# EAGLE design futurew (EAGLE 9.5.2)
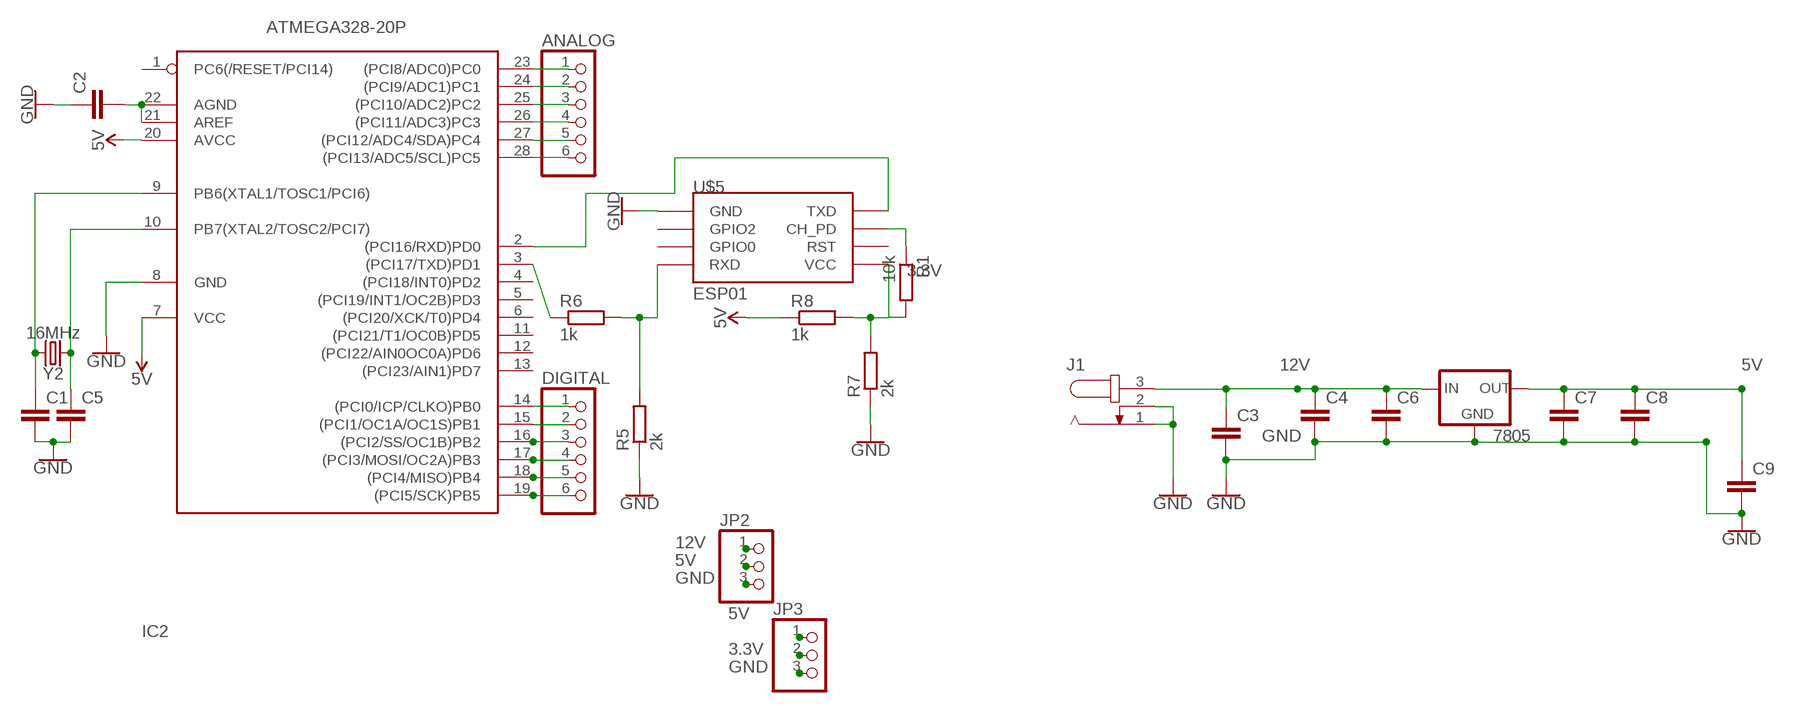
[diagram p0: schematic, sheet 1]

## Parts
7805  78XXL  [78XXL]
ANALOG  PINHD-1X6  [1X06]
C1  C2,5-3  [C2.5-3]
C2  C2,5-3  [C2.5-3]
C3  C2,5-3  [C2.5-3]
C4  C2,5-3  [C2.5-3]
C5  C2,5-3  [C2.5-3]
C6  C2,5-3  [C2.5-3]
C7  C2,5-3  [C2.5-3]
C8  C2,5-3  [C2.5-3]
C9  C2,5-3  [C2.5-3]
DIGITAL  PINHD-1X6  [1X06]
IC2  ATMEGA328-20P  [DIL28-3]
J1  JACK-PLUG1  [SPC4078]
JP2  PINHD-1X3  [1X03]
JP3  PINHD-1X3  [1X03]
R1  10k  R-EU_0204/5  [0204/5]
R5  2k  R-EU_0204/5  [0204/5]
R6  1k  R-EU_0204/5  [0204/5]
R7  2k  R-EU_0204/5  [0204/5]
R8  1k  R-EU_0204/5  [0204/5]
U$5  ESP01  [ESP01]
Y2  16MHz  CRYSTAL-16MHZPTH-HC49US  [HC49US]

## Nets
3.3V: JP3.2 R7.2 R8.2 U$5.VCC
5V: 7805.OUT C7.1 C8.1 C9.1 IC2.7(VCC) IC2.20(AVCC) JP2.2 JP3.1 R8.1
12V: 7805.IN C3.1 C4.1 C6.1 J1.3 JP2.1
GND: 7805.GND C1.2 C2.1 C3.2 C4.2 C5.2 C6.2 C7.2 C8.2 C9.2 IC2.8(GND) J1.1 J1.2 JP2.3 JP3.3 R5.1 R7.1 U$5.GND
N$1: R5.2 R6.2 U$5.RX(RXD)
N$2: IC2.3((PCI17/TXD)PD1) R6.1
N$3: IC2.2((PCI16/RXD)PD0) U$5.TX(TXD)
N$4: DIGITAL.6 IC2.19((PCI5/SCK)PB5)
N$5: DIGITAL.5 IC2.18((PCI4/MISO)PB4)
N$6: DIGITAL.4 IC2.17((PCI3/MOSI/OC2A)PB3)
N$7: DIGITAL.3 IC2.16((PCI2/SS/OC1B)PB2)
N$8: ANALOG.1 IC2.23((PCI8/ADC0)PC0)
N$9: ANALOG.2 IC2.24((PCI9/ADC1)PC1)
N$10: ANALOG.3 IC2.25((PCI10/ADC2)PC2)
N$11: C2.2 IC2.21(AREF) IC2.22(AGND)
N$12: ANALOG.4 IC2.26((PCI11/ADC3)PC3)
N$13: ANALOG.5 IC2.27((PCI12/ADC4/SDA)PC4)
N$14: ANALOG.6 IC2.28((PCI13/ADC5/SCL)PC5)
N$15: DIGITAL.1 IC2.14((PCI0/ICP/CLKO)PB0)
N$16: DIGITAL.2 IC2.15((PCI1/OC1A/OC1S)PB1)
N$17: R1.1 U$5.CH_PD
N$18: R1.2
N$43: C5.1 IC2.10(PB7(XTAL2/TOSC2/PCI7)) Y2.1
N$45: C1.1 IC2.9(PB6(XTAL1/TOSC1/PCI6)) Y2.2
Unconnected: IC2.1(PC6(/RESET/PCI14)) IC2.4((PCI18/INT0)PD2) IC2.5((PCI19/INT1/OC2B)PD3) IC2.6((PCI20/XCK/T0)PD4) IC2.11((PCI21/T1/OC0B)PD5) IC2.12((PCI22/AIN0OC0A)PD6) IC2.13((PCI23/AIN1)PD7) U$5.GPIO0 U$5.GPIO2 U$5.RST

## Library data of the parts
7805 = v-reg:78XXL: VOLTAGE REGULATOR
ANALOG DIGITAL = pinhead:PINHD-1X6: PIN HEADER
C1-C9 = capacitor-wima:C: CAPACITOR naming: grid - package width
IC2 = atmega328:ATMEGA328*P: MICROCONTROLLER 32 kBytes FLASH 2 kBytes SRAM 1 kBytes EEPROM USART 8-channel 10 bit ADC
J1 = con-jack:JACK-PLUG: DC POWER JACK Power Jack, DC, Right Angle, Through Hole, Rated 5A at 16VDC, PC Terminals Distributor: Farnell (www.Farnell.de) Drawing: 84N1161.pdf / 84N1162.pdf Manufacturer: SPC Technology (www.spctechnology.com) Type: SPC4077 / SPC 4078; OC_FARNELL: unknown; OC_NEWARK: unknown
JP2 JP3 = pinhead:PINHD-1X3: PIN HEADER
R1 R5-R8 = resistor:R-EU_: RESISTOR, European symbol
U$5 = esp8266modules:ESP01: ESP8266 Wifi module 01
Y2 = SparkFun-Clocks:CRYSTAL-16MHZ: 16MHz Crystal Digikey Example <http://www.digikey.com/product-search/en?keywords=535-9122-1-ND> Frequency: 16MHz Frequency Stability: ±50ppm Frequency Tolerance: ±20ppm Load Capacitance: 18pF SparkFun Products: Pro Micro -5V/16MHz <https://www.sparkfun.com/products/12640> SparkFun Serial Enabled LCD Kit <https://www.sparkfun.com/products/10097>; PROD_ID: XTAL-08181; SF_ID: COM-00536

## Net classes
0 default: width 1.016 mm, clearance 0.381 mm

## Board
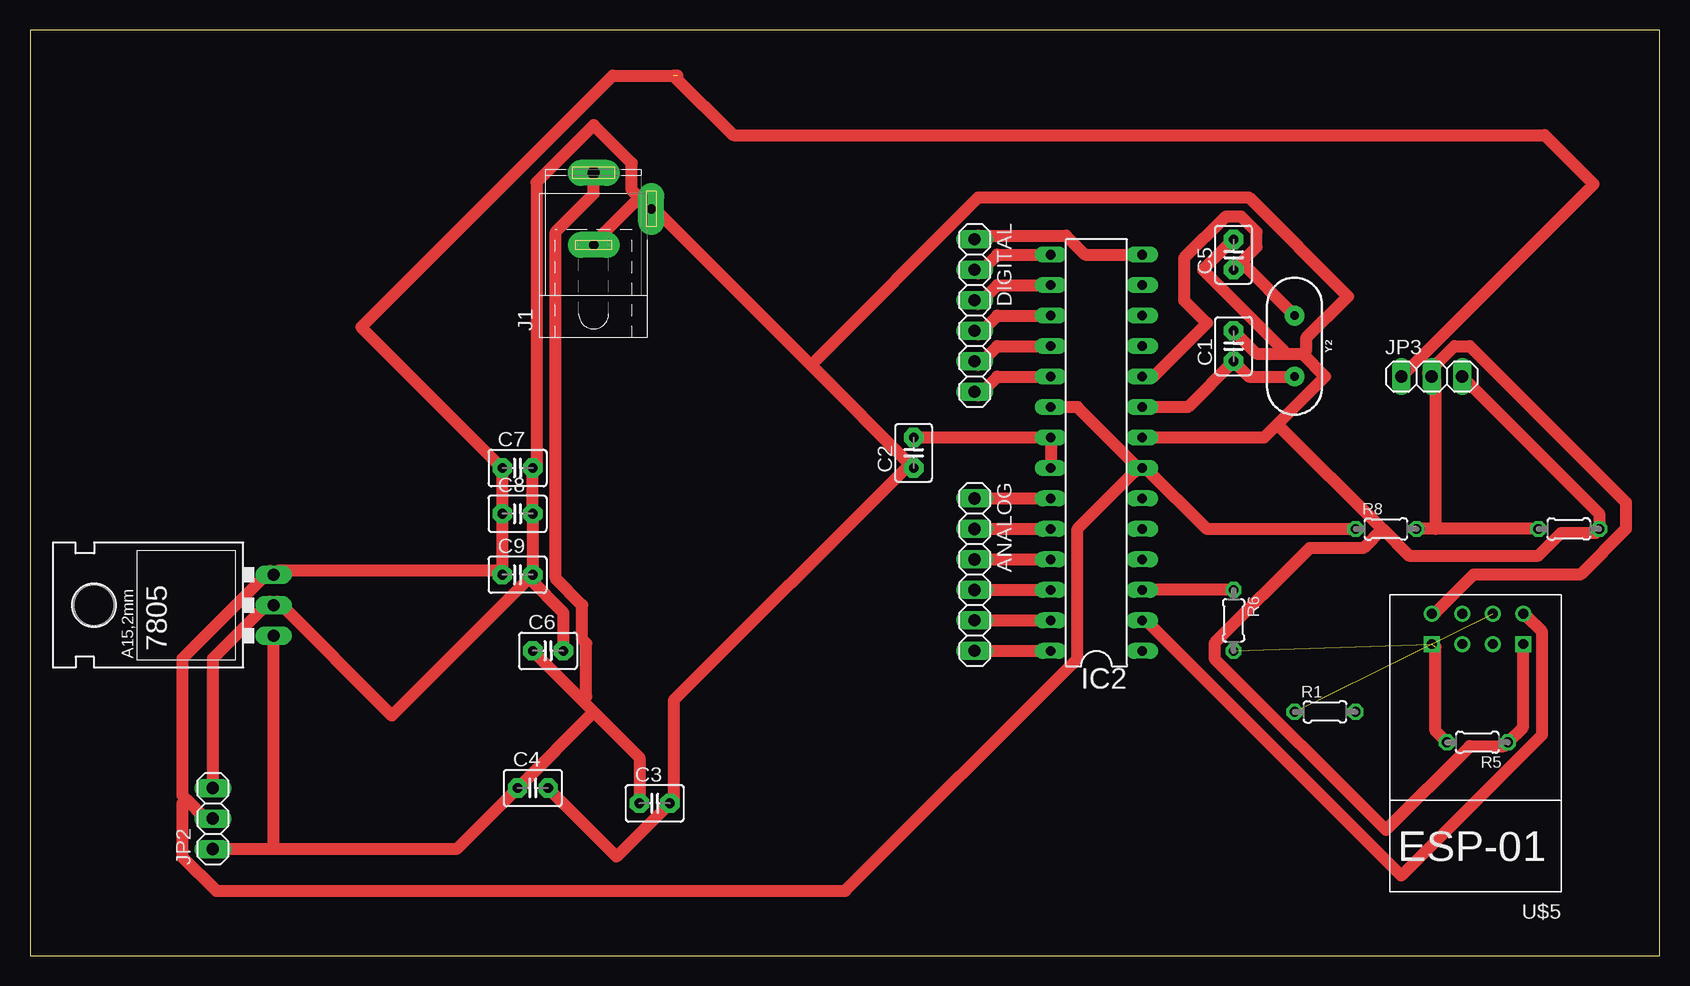
[diagram p1: board, top side]

Size 135.87 x 77.14 mm. Coordinates in mm from the lower left corner, seen from the top.
Outline: 0,0 135.87,0 135.87,77.14 0,77.14 0,0
Copper layers (1*16): Top 0.035mm / dielectric 1.5mm / Bottom 0.035mm
Design rules "default": minimum track width 6mil, minimum drill 0.35mm, track to track 6mil, track to pad 6mil, pad to pad 6mil, via to via 6mil, smd to smd 6mil, copper to edge 40mil, drill to drill 6mil, minimum pad ring 10mil, minimum via ring 8mil, stop-mask expansion 4mil, vias tented up to drill 0mil, thermal gap 10mil

### Footprints (pad centres in the part's own frame; a part is rotated, then mirrored left to right if it is on the bottom)
78XXL = drill 1.016 long: GND 0,-3.81; IN -2.54,-3.81; OUT 2.54,-3.81 | hole 3.302: 0,11.176
1X06 = drill 1.016 long: 1 -6.35,0; 2 -3.81,0; 3 -1.27,0; 4 1.27,0; 5 3.81,0; 6 6.35,0
C2.5-3 = drill 0.813 pad 1.6 octagon: 1 -1.27,0; 2 1.27,0
DIL28-3 = drill 0.813 long: 1 -16.51,-3.81; 2 -13.97,-3.81; 3 -11.43,-3.81; 4 -8.89,-3.81; 5 -6.35,-3.81; 6 -3.81,-3.81; 7 -1.27,-3.81; 8 1.27,-3.81; 9 3.81,-3.81; 10 6.35,-3.81; 11 8.89,-3.81; 12 11.43,-3.81; 13 13.97,-3.81; 14 16.51,-3.81; 15 16.51,3.81; 16 13.97,3.81; 17 11.43,3.81; 18 8.89,3.81; 19 6.35,3.81; 20 3.81,3.81; 21 1.27,3.81; 22 -1.27,3.81; 23 -3.81,3.81; 24 -6.35,3.81; 25 -8.89,3.81; 26 -11.43,3.81; 27 -13.97,3.81; 28 -16.51,3.81
SPC4078 = drill 0.8 pad 2.184 long: 1 -3,0; 2 0,-4.8 | drill 1 pad 2.184 long: 3 3,0
1X03 = drill 1.016 long: 1 -2.54,0; 2 0,0; 3 2.54,0
0204/5 = drill 0.813 octagon: 1 -2.54,0; 2 2.54,0
ESP01 = drill 0.8: CH_PD -1.285,-8.178; GPIO0 1.255,-5.638; GPIO2 -1.285,-5.638; RST 1.255,-8.178; TX -3.825,-8.178; VCC 3.795,-8.178 | drill 0.8 square: GND -3.825,-5.638; RX 3.795,-5.638
HC49US = drill 0.7 pad 1.651: 1 -2.54,0; 2 2.54,0

### Placement (x,y rotation side)
7805  16.51,29.21 90 top
ANALOG  78.74,31.75 270 top
C1  100.33,50.8 90 top
C2  73.66,41.91 90 top
C3  52.07,12.7 0 top
C4  41.91,13.97 0 top
C5  100.33,58.42 90 top
C6  43.18,25.4 0 top
C7  40.64,40.64 0 top
C8  40.64,36.83 0 top
C9  40.64,31.75 0 top
DIGITAL  78.74,53.34 270 top
IC2  88.9,41.91 90 top
J1  46.99,62.23 90 top
JP2  15.24,11.43 90 top
JP3  116.84,48.26 0 top
R1  107.95,20.32 0 top
R5  120.65,17.78 180 top
R6  100.33,27.94 270 top
R7  128.27,35.56 180 top
R8  113.03,35.56 0 top
U$5  120.65,20.32 180 top
Y2  105.41,50.8 270 top

### Tracks (layer width: path | path; a pad name or v marks a point on that pad's centre or on a via)
3.3V
  Top 1.016: R7.2 117.16,35.56 | 117.16,35.56 R8.2 | U$5.VCC 117.16,28.57 120.33,31.75 129.22,31.75 133.03,35.56 133.03,37.78 120.02,50.8 118.75,50.8 116.52,48.58 JP3.2 117.16,47.94 117.16,35.56
5V  (1 unrouted)
  Top 1.016: IC2.20 87.31,45.72 92.39,40.64 IC2.7 | R8.1 98.11,35.56 93.03,40.64 IC2.7 | JP2.2 14.61,11.43 13.02,13.02 | 13.02,13.02 12.7,13.34 12.7,24.77 20,32.07 7805.OUT 20.64,32.07 39.05,32.07 C9.1 C8.1 C7.1 27.62,52.39 48.58,73.34 53.98,73.34 | JP3.1 130.33,64.29 126.25,68.37 58.63,68.37 53.66,73.34 | IC2.7 92.08,40.32 87.31,35.56 87.31,24.77 67.94,5.4 15.56,5.4 12.7,8.26 12.7,12.7 13.02,13.02
12V
  Top 1.016: 20.32,8.89 35.56,8.89 C4.1 46.99,20.32 | 20.32,8.89 JP2.1 | 20.32,8.89 7805.IN | C3.1 50.8,16.51 46.99,20.32 | C6.1 46.04,21.27 | 46.04,21.27 46.99,20.32 | J1.3 46.99,63.5 43.81,60.33 43.81,31.43 46.04,29.21 46.04,26.35 46.35,26.04 46.35,21.59 46.04,21.27
GND
  Top 1.016: JP3.3 130.81,36.83 R7.1 130.49,35.24 127.64,35.24 125.73,33.34 114.94,33.34 112.71,35.56 | U$5.GND 124.46,25.72 124.46,19.05 R5.1 122.87,17.46 120.02,17.46 113.03,10.48 98.74,24.77 98.74,26.04 106.68,33.97 111.12,33.97 112.71,35.56 | IC2.8 102.87,43.18 103.98,44.29 | 103.98,44.29 107.95,48.26 106.05,50.16 | 104.46,50.16 102.23,50.16 C1.2 | 104.46,50.16 106.05,50.16 | C5.2 97.79,57.15 104.46,50.48 104.46,50.16 | 103.98,44.29 112.71,35.56 | C6.2 44.45,28.57 41.59,31.43 | 41.59,31.43 C9.2 C8.2 C7.2 42.23,40.96 42.23,64.45 46.99,69.22 50.16,66.04 50.16,63.82 50.8,63.18 | JP2.3 15.24,24.77 20,29.53 7805.GND 20.64,29.53 30.16,20 41.59,31.43 | C4.2 48.9,8.26 C3.2 53.66,13.02 53.66,21.27 73.03,40.64 C2.1 65.09,49.21 | 65.09,49.21 52.07,62.23 J1.2 51.44,62.55 50.8,63.18 | 50.8,63.18 46.99,59.37 J1.1 | 65.09,49.21 79.06,63.18 101.6,63.18 109.86,54.93 106.36,51.44 106.36,50.48 106.05,50.16
N$1  (2 unrouted)
  Top 1.016: 117.16,25.72 117.16,18.73 R5.2
N$2
  Top 1.016: R6.1 IC2.3
N$3
  Top 1.016: IC2.2 93.03,27.94 114.3,6.67 126.05,18.41 126.05,26.99 124.78,28.26 U$5.TX
N$4
  Top 1.016: IC2.19 80.64,48.26 79.06,46.67 DIGITAL.6
N$5
  Top 1.016: IC2.18 80.64,50.8 79.06,49.21 DIGITAL.5
N$6
  Top 1.016: IC2.17 80.64,53.34 79.06,51.75 DIGITAL.4
N$7
  Top 1.016: IC2.16 80.64,55.88 79.06,54.29 DIGITAL.3
N$8
  Top 1.016: ANALOG.1 IC2.23
N$9
  Top 1.016: ANALOG.2 IC2.24
N$10
  Top 1.016: ANALOG.3 IC2.25
N$11
  Top 1.016: IC2.22 IC2.21 C2.2
N$12
  Top 1.016: ANALOG.4 IC2.26
N$13
  Top 1.016: ANALOG.5 IC2.27
N$14
  Top 1.016: ANALOG.6 IC2.28
N$15
  Top 1.016: IC2.14 87.95,58.42 86.36,60.01 79.06,60.01 DIGITAL.1
N$16
  Top 1.016: IC2.15 80.64,58.42 79.06,56.83 DIGITAL.2
N$17  (1 unrouted)
N$43
  Top 1.016: IC2.10 93.66,48.26 98.11,52.7 96.2,54.61 96.2,58.1 99.69,61.59 100.97,61.59 102.23,60.33 102.23,59.05 100.97,57.78 | C5.1 100.97,57.78 | 100.97,57.78 Y2.1
N$45
  Top 1.016: IC2.9 96.52,45.72 C1.1 101.6,48.26 Y2.2